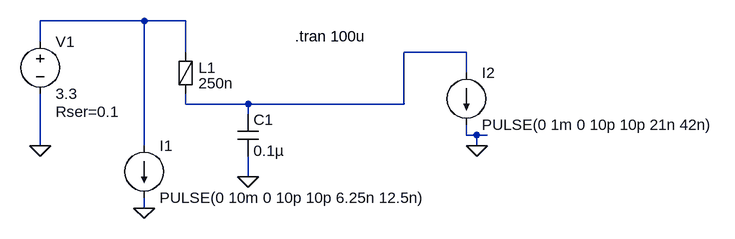
[diagram p0: schematic ferrite_bead.asc]
ferrite_bead.asc, the LTspice schematic file:
Version 4
SHEET 1 996 680
WIRE 96 64 -64 64
WIRE 160 64 96 64
WIRE -64 96 -64 64
WIRE 160 112 160 64
WIRE 592 112 496 112
WIRE 592 144 592 112
WIRE 160 192 160 176
WIRE 256 192 160 192
WIRE 496 192 496 112
WIRE 496 192 256 192
WIRE 256 208 256 192
WIRE 592 240 592 224
WIRE 608 240 592 240
WIRE 624 240 608 240
WIRE -64 256 -64 176
WIRE 96 256 96 64
WIRE 608 256 608 240
WIRE 256 304 256 272
WIRE 96 352 96 336
FLAG 256 304 0
FLAG -64 256 0
FLAG 96 352 0
FLAG 608 256 0
SYMBOL FerriteBead 160 144 R0
SYMATTR InstName L1
SYMATTR Value 250n
SYMATTR SpiceLine Rser=0.1 Cpar=33p
SYMBOL voltage -64 80 R0
WINDOW 123 0 0 Left 0
WINDOW 39 24 124 Left 2
SYMATTR InstName V1
SYMATTR Value 3.3
SYMATTR SpiceLine Rser=0.1
SYMBOL cap 240 208 R0
SYMATTR InstName C1
SYMATTR Value 0.1µ
SYMBOL current 96 256 R0
WINDOW 123 0 0 Left 0
WINDOW 39 0 0 Left 0
SYMATTR InstName I1
SYMATTR Value PULSE(0 10m 0 10p 10p 6.25n 12.5n)
SYMBOL current 592 144 R0
WINDOW 123 0 0 Left 0
WINDOW 39 0 0 Left 0
SYMATTR InstName I2
SYMATTR Value PULSE(0 1m 0 10p 10p 21n 42n)
TEXT 328 88 Left 2 !.tran 100u

The netlist it stands for:
* ferrite_bead.asc
L1 N001 N002 250n Rser=0.1 Cpar=33p
V1 N001 0 3.3 Rser=0.1
C1 N002 0 0.1µ
I1 N001 0 PULSE(0 10m 0 10p 10p 6.25n 12.5n)
I2 N002 0 PULSE(0 1m 0 10p 10p 21n 42n)
.tran 100u
.backanno
.end